# EAGLE schematic numitron_tube_clock (EAGLE 7.4.0)
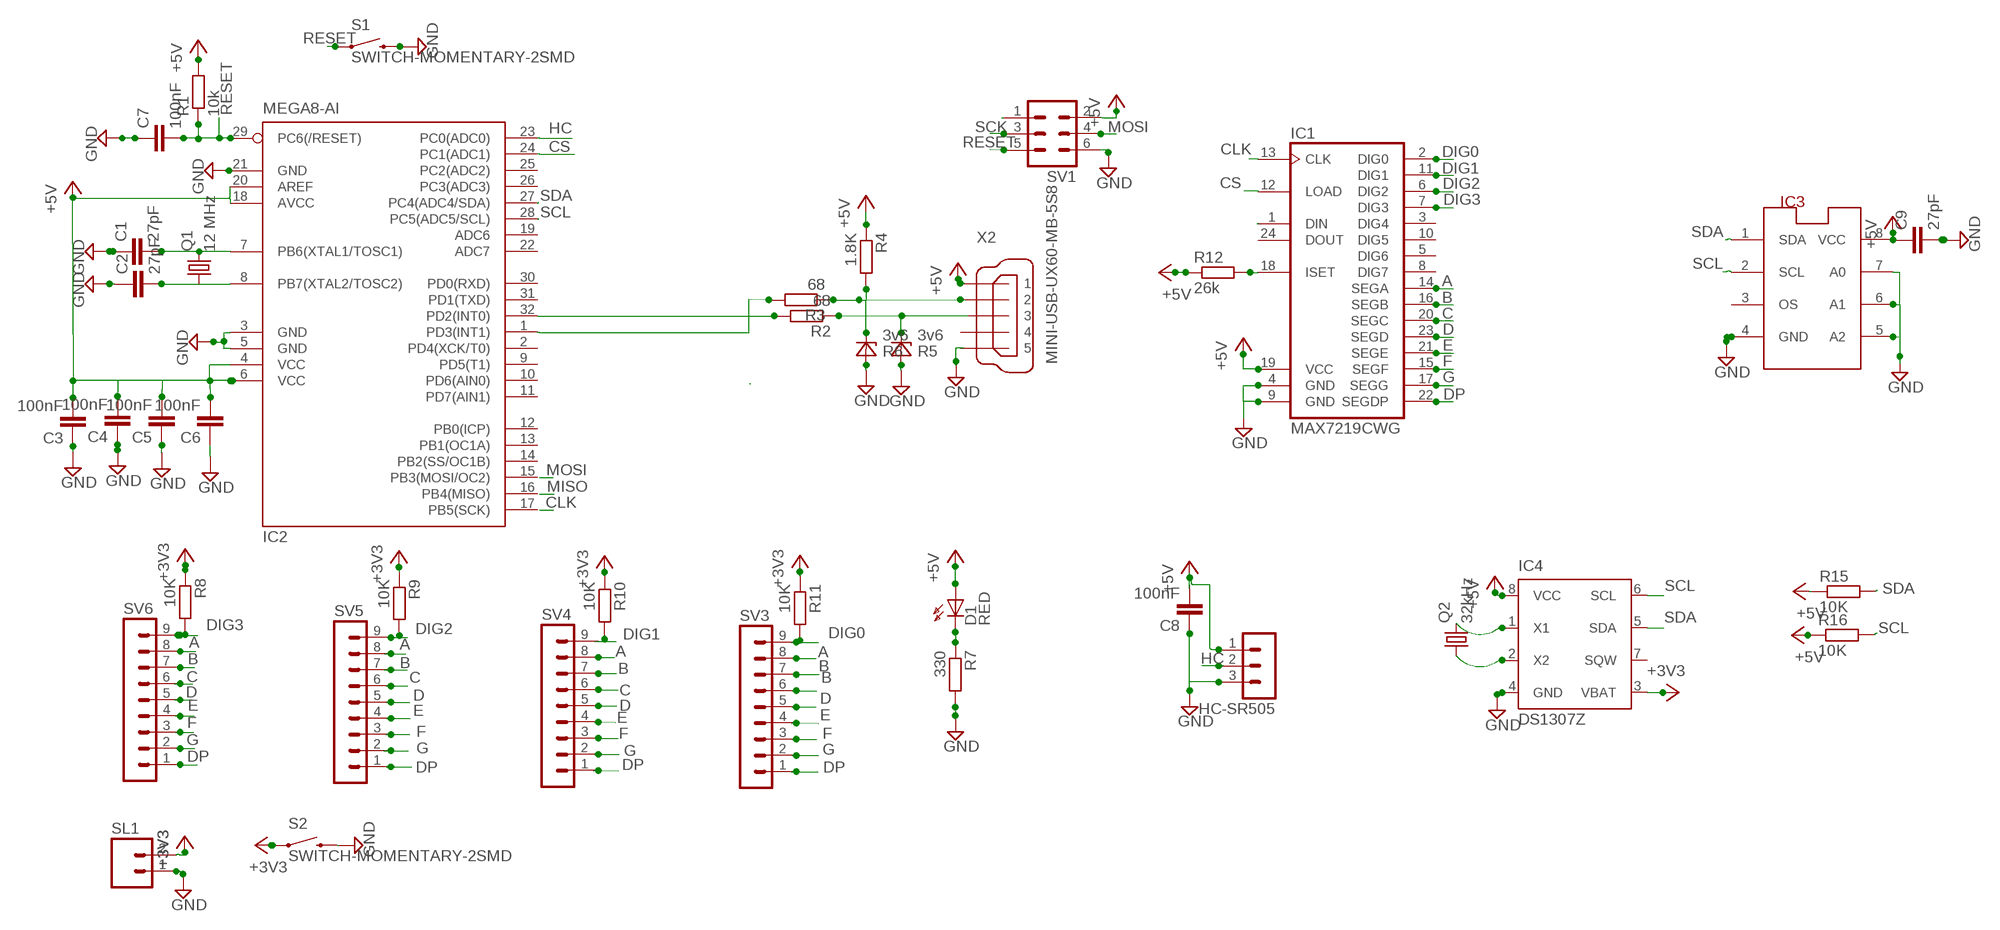
[diagram p0: schematic, sheet 1]

## Parts
C1  27pF  C-EUC0805  [C0805]
C2  27pF  C-EUC0805  [C0805]
C3  100nF  C-EUC0805  [C0805]
C4  100nF  C-EUC0805  [C0805]
C5  100nF  C-EUC0805  [C0805]
C6  100nF  C-EUC0805  [C0805]
C7  100nF  C-EUC0805  [C0805]
C8  100nF  C-EUC0805  [C0805]
C9  27pF  C-EUC0805  [C0805]
D1  RED  HLMP6  [HLMP6]
HC-SR505  MA03-1  [MA03-1]
IC1  MAX7219CWG  [SO24L]
IC2  MEGA8-AI  [TQFP32-08]
IC3  LM75_ICN  [SO8_LM75]
IC4  DS1307Z  [SOIC8]
Q1  12 MHz  CRYSTALHC49U-V  [HC49U-V]
Q2  32kHz  CRYSTALHC49U-V  [HC49U-V]
R1  10k  R-EU_M0805  [M0805]
R2  68  R-EU_M0805  [M0805]
R3  68  R-EU_M0805  [M0805]
R4  1.8K  R-EU_M0805  [M0805]
R5  3v6  Z-DIODE  [Z-DIODE]
R6  3v6  Z-DIODE  [Z-DIODE]
R7  330  R-EU_M0805  [M0805]
R8  10K  R-EU_M0805  [M0805]
R9  10K  R-EU_M0805  [M0805]
R10  10K  R-EU_M0805  [M0805]
R11  10K  R-EU_M0805  [M0805]
R12  26k  R-EU_M0805  [M0805]
R15  10K  R-EU_M0805  [M0805]
R16  10K  R-EU_M0805  [M0805]
S1  SWITCH-MOMENTARY-2SMD  [TACTILE-SWITCH-SMD]
S2  SWITCH-MOMENTARY-2SMD  [TACTILE-SWITCH-SMD]
SL1  MA02  [02PA]
SV1  MA03-2  [MA03-2]
SV3  MA09-1  [MA09-1]
SV4  MA09-1  [MA09-1]
SV5  MA09-1  [MA09-1]
SV6  MA09-1  [MA09-1]
X2  MINI-USB-UX60-MB-5S8  [UX60-MB-5S8]

## Nets
+3V3: IC4.3(VBAT) R11.1 S2.1
+5V: C3.2 C4.2 C5.2 C6.2 C8.2 D1.A IC1.19(VCC) IC2.6(VCC) IC2.18(AVCC) IC2.20(AREF) IC4.8(VCC) R4.1 R12.1 R15.1 R16.1 X2.1
A: IC1.14(SEGA) SV3.8 SV4.8 SV5.8 SV6.8
B: IC1.16(SEGB) SV3.7 SV4.7 SV5.7 SV6.7
C: IC1.20(SEGC) SV4.6 SV5.6 SV6.6
CLK: IC1.13(CLK)
CS: IC1.12(LOAD) IC2.24(PC1(ADC1))
D: IC1.23(SEGD) SV3.5 SV4.5 SV5.5 SV6.5
DIG0: IC1.2(DIG0) SV3.9
DIG1: IC1.11(DIG1)
DIG2: IC1.6(DIG2) SV5.9
DIG3: IC1.7(DIG3) R8.2 SV6.9
DP: IC1.22(SEGDP) SV3.1 SV4.1 SV5.1 SV6.1
E: IC1.21(SEGE) SV3.4 SV4.4 SV5.4 SV6.4
F: IC1.15(SEGF) SV3.3 SV4.3 SV5.3 SV6.3
G: IC1.17(SEGG) SV3.2 SV4.2 SV5.2 SV6.2
GND: C1.1 C3.1 C4.1 C5.1 C6.1 C7.1 C8.1 C9.2 HC-SR505.3 IC2.3(GND) IC2.5(GND) IC2.21(GND) IC3.6(A1) IC3.7(A0) IC4.4(GND) R5.A R7.2 S1.3 S2.3 SL1.1 SV1.6
HC: HC-SR505.2 IC2.23(PC0(ADC0))
MISO: SV1.1
MOSI: IC1.1(DIN) SV1.4
N$1: C1.2 Q1.2
N$2: C2.2 Q1.1
N$3: HC-SR505.1
N$4: R3.2
N$5: S1.1
N$6: R2.1 X2.3
N$7: R3.1 R4.2 X2.2
N$9: IC2.32(PD2(INT0)) R2.2
N$12: R1.1
N$14: C9.1 IC3.8(VCC)
N$15: IC2.4(VCC)
N$16: R11.2
N$17: IC1.18(ISET) R12.2
N$18: IC2.8(PB7(XTAL2/TOSC2))
N$19: IC2.7(PB6(XTAL1/TOSC1))
N$20: IC2.1(PD3(INT1))
N$21: R9.2
N$22: R8.1
N$23: R6.A
N$24: R5.C
N$26: R6.C
N$28: SL1.2
N$29: C2.1
N$30: D1.K R7.1
N$31: SV1.2
N$32: R1.2
N$35: IC4.2(X2) Q2.1
N$36: IC4.1(X1) Q2.2
N$39: IC3.4(GND)
N$42: IC1.4(GND) IC1.9(GND)
N$45: SV3.6
N$48: IC3.5(A2)
RESET: C7.2 IC2.29(PC6(/RESET)) SV1.5
SCK: SV1.3
SCL: IC2.28(PC5(ADC5/SCL)) IC3.2(SCL) IC4.6(SCL) R16.2
SDA: IC2.27(PC4(ADC4/SDA)) IC3.1(SDA) IC4.5(SDA) R15.2
Unconnected: IC1.3(DIG4) IC1.5(DIG6) IC1.8(DIG7) IC1.10(DIG5) IC1.24(DOUT) IC2.2(PD4(XCK/T0)) IC2.9(PD5(T1)) IC2.10(PD6(AIN0)) IC2.11(PD7(AIN1)) IC2.12(PB0(ICP)) IC2.13(PB1(OC1A)) IC2.14(PB2(SS/OC1B)) IC2.15(PB3(MOSI/OC2)) IC2.16(PB4(MISO)) IC2.17(PB5(SCK)) IC2.19(ADC6) IC2.22(ADC7) IC2.25(PC2(ADC2)) IC2.26(PC3(ADC3)) IC2.30(PD0(RXD)) IC2.31(PD1(TXD)) IC3.3(OS) IC4.7(SQW) R9.1 R10.1 R10.2 SV4.9 X2.4 X2.5

## Library data of the parts
C1-C9 = resistor:C-EU: CAPACITOR, European symbol
D1 = display-hp:HLMP6: LED 2mm horizontal; MF: AGILENT TECHNOLOGIES; MPN: HLMP-6500; OC_FARNELL: 1652490; OC_NEWARK: 40K0088
HC-SR505 = con-lstb:MA03-1: PIN HEADER; OC_FARNELL: unknown; OC_NEWARK: unknown
IC1 = max7219:MAX7219CWG
IC2 = atmel:MEGA8: MICROCONTROLLER 8 Kbytes FLASH, 1 kbytes SRAM, 512 bytes EEPROM, USART, 6-channel 10 bit ADC, 2-channel 8 bit ADC Pin compatible with Atmega48, ATMega88, ATMega168 Source: avr.lbr; MPN: ATMEGA8-16AU; OC_FARNELL: 9171371; OC_NEWARK: 73M8863
IC3 = lm75:LM75_IC: Temperatursensor
IC4 = ds1307_pcf8583:DS1307: I2C-Bus CLOCK/CALENDAR
Q1 Q2 = crystal:CRYSTAL: CRYSTAL; OC_FARNELL: 1666969; OC_NEWARK: unknown
R1-R4 R7-R12 R15 R16 = resistor:R-EU_: RESISTOR, European symbol
R5 R6 = e-halbleiter:Z-DIODE: Z-Diode
S1 S2 = SparkFun-Electromechanical:SWITCH-MOMENTARY-2: Various NO switches- pushbuttons, reed, etc; PROD_ID: SWCH-08247
SL1 = con-amp-quick:MA02: AMP QUICK CONNECTOR; OC_FARNELL: unknown; OC_NEWARK: unknown
SV1 = con-lstb:MA03-2: PIN HEADER; OC_FARNELL: unknown; OC_NEWARK: unknown
SV3-SV6 = con-lstb:MA09-1: PIN HEADER; OC_FARNELL: unknown; OC_NEWARK: unknown
X2 = con-hirose:MINI-USB-: MINI USB Connector Source: http://www.hirose.co.jp/cataloge_hp/e24000019.pdf; OC_FARNELL: unknown; OC_NEWARK: unknown